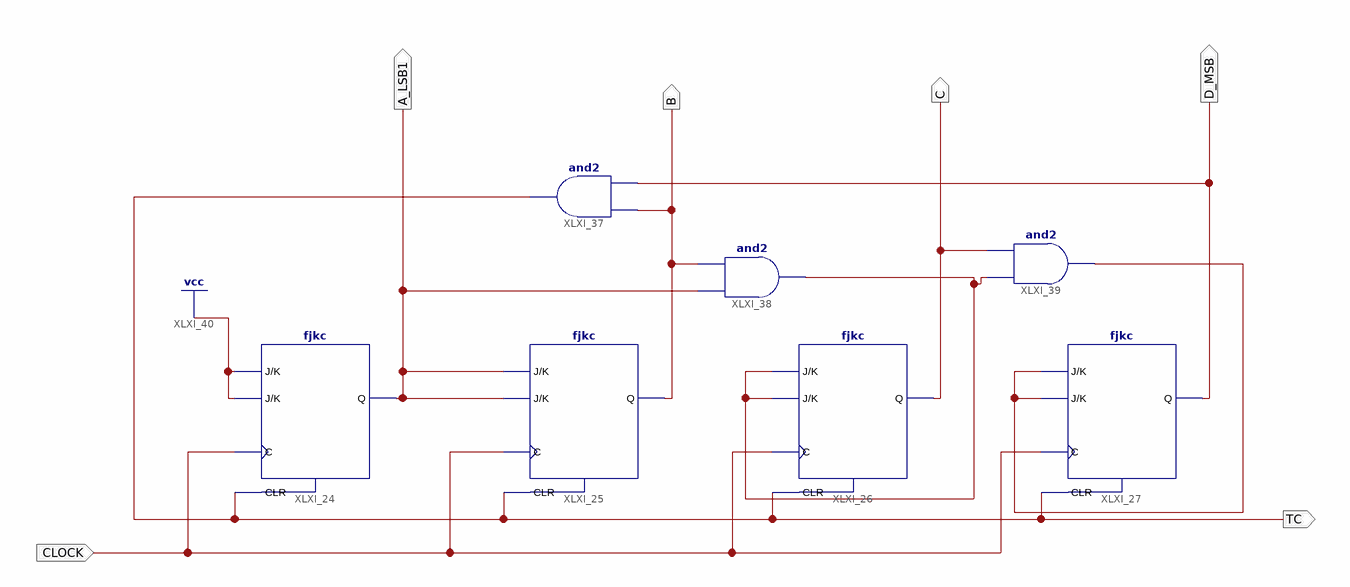
[diagram p0: schematic sheet 1]
// Xilinx ISE schematic Counter.sch (spartan6) as structural Verilog: 7 symbols, 6 ports
module Counter (
  input  CLOCK,
  output D_MSB,
  output B,
  output TC,
  output A_LSB1,
  output C
);

  wire XLXN_29, XLXN_31;

  fjkc XLXI_24 (.C(CLOCK), .CLR(TC), .J(1'b1), .K(1'b1), .Q(A_LSB1));
  fjkc XLXI_25 (.C(CLOCK), .CLR(TC), .J(A_LSB1), .K(A_LSB1), .Q(B));
  fjkc XLXI_26 (.C(CLOCK), .CLR(TC), .J(XLXN_29), .K(XLXN_29), .Q(C));
  fjkc XLXI_27 (.C(CLOCK), .CLR(TC), .J(XLXN_31), .K(XLXN_31), .Q(D_MSB));
  and XLXI_37 (TC, B, D_MSB);
  and XLXI_38 (XLXN_29, A_LSB1, B);
  and XLXI_39 (XLXN_31, XLXN_29, C);
endmodule
